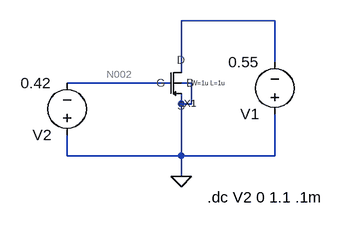
[diagram p0: schematic test1.asc]
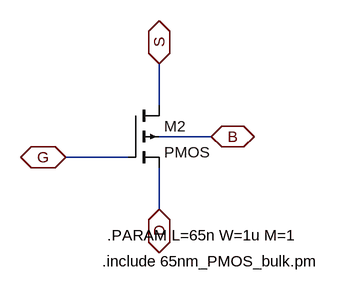
[diagram p1: sub-circuit pmos65.asc]
test1.asc, the LTspice schematic file:
Version 4
SHEET 1 880 680
WIRE 208 64 64 64
WIRE 208 128 208 64
WIRE 64 144 64 64
WIRE 48 160 -112 160
WIRE 80 160 64 160
WIRE 64 192 64 176
WIRE 80 192 80 160
WIRE 80 192 64 192
WIRE -112 272 -112 240
WIRE 64 272 64 192
WIRE 64 272 -112 272
WIRE 208 272 208 208
WIRE 208 272 64 272
WIRE 64 304 64 272
FLAG 64 304 0
SYMBOL voltage 208 224 R180
WINDOW 123 0 0 Left 0
WINDOW 39 0 0 Left 0
SYMATTR InstName V1
SYMATTR Value 0.55
SYMBOL voltage -112 256 R180
WINDOW 123 0 0 Left 0
WINDOW 39 0 0 Left 0
SYMATTR InstName V2
SYMATTR Value 0.42
SYMBOL pmos65 80 160 M180
WINDOW 39 0 0 Left 0
SYMATTR InstName X1
SYMATTR SpiceLine W=1u L=1u
TEXT 104 336 Left 2 !.dc V2 0 1.1 .1m

pmos65.asc, the sub-circuit schematic file:
Version 4
SHEET 1 880 680
WIRE 160 80 160 16
WIRE 240 128 160 128
WIRE 112 160 16 160
WIRE 160 240 160 176
FLAG 16 160 G
IOPIN 16 160 BiDir
FLAG 160 240 D
IOPIN 160 240 BiDir
FLAG 160 16 S
IOPIN 160 16 BiDir
FLAG 240 128 B
IOPIN 240 128 BiDir
SYMBOL pmos4 112 80 R0
SYMATTR InstName M2
SYMATTR Value2 l={L} w={W} ad='2*65n*{W}' as='2*65n*{W}' pd='2*(2*65n+{W})' ps='2*(2*65n+{W})' m={M}
TEXT 80 280 Left 2 !.PARAM L=65n W=1u M=1
TEXT 72 320 Left 2 !.include 65nm_PMOS_bulk.pm

The netlist it stands for:
* test1.asc
V1 0 N001 0.55
V2 0 N002 0.42
XX1 N002 N001 0 0 pmos65 params: W=1u L=1u

* block symbol definitions
.subckt pmos65 G D S B
M2 S G D B PMOS l={L} w={W} ad='2*65n*{W}' as='2*65n*{W}' pd='2*(2*65n+{W})' ps='2*(2*65n+{W})' m={M}
.PARAM L=65n W=1u M=1
.include 65nm_PMOS_bulk.pm
.ends pmos65

.model NMOS NMOS
.model PMOS PMOS
.lib standard.mos
.dc V2 0 1.1 .1m
.backanno
.end

* Results of the author's LTspice run, read from the files saved beside the schematic
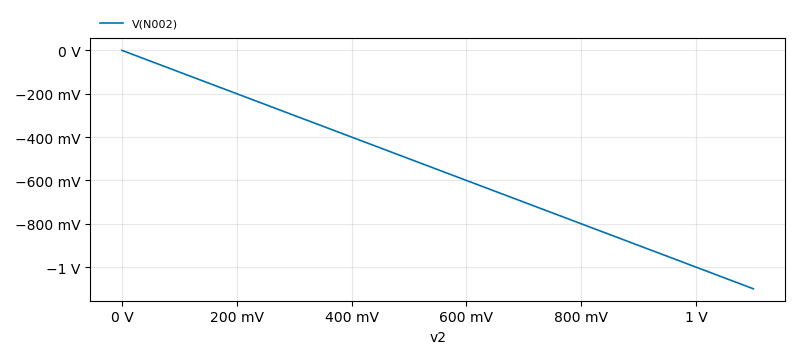
[diagram p2: DC transfer characteristic of test1.asc, plotted from the saved traces]
* DC transfer characteristic, 1 run:
*   V(N002): 0 V at v2=0 V, -1.1 V at v2=1.1 V, min -1.1 V, max 0 V